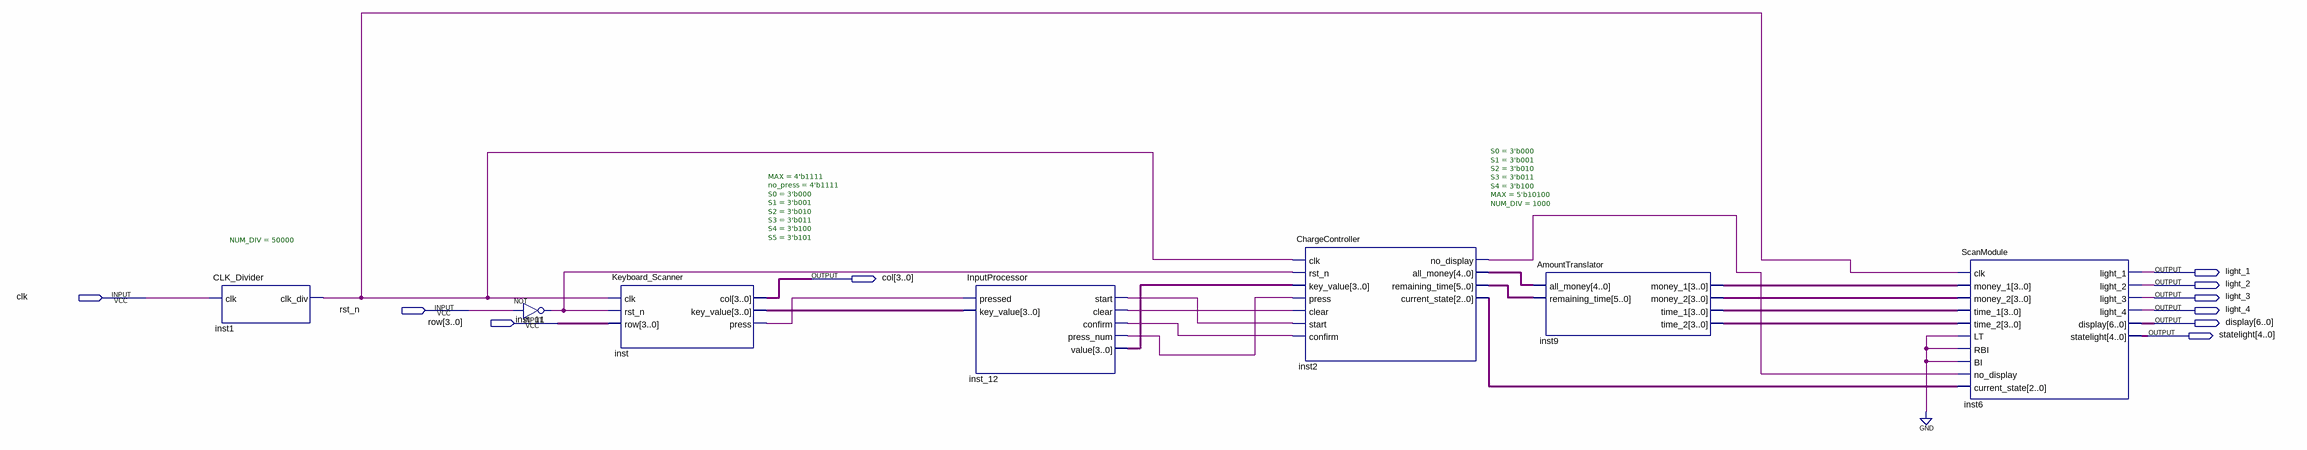
[diagram p0: schematic sheet]
// Quartus schematic main.bdf as structural Verilog: 7 symbols, 10 pins
module main (
  input  clk,
  input  rst_n,
  input  [3:0] row,
  output light_1,
  output [3:0] col,
  output light_2,
  output light_3,
  output light_4,
  output [6:0] display,
  output [4:0] statelight
);

  wire inst1_clk_div, inst2_no_display, inst_11_out, inst_12_clear, inst_12_confirm, inst_12_press_num,
       inst_12_start, inst_press;
  wire [2:0] inst2_current_state;
  wire [3:0] inst9_money_1, inst9_money_2, inst9_time_1, inst9_time_2, inst_12_value, inst_key_value;
  wire [4:0] inst2_all_money;
  wire [5:0] inst2_remaining_time;

  CLK_Divider #(.NUM_DIV(50000)) inst1 (.clk(clk), .clk_div(inst1_clk_div));
  not inst_11 (inst_11_out, rst_n);
  Keyboard_Scanner #(.MAX(4'b1111), .no_press(4'b1111), .S0(3'b000), .S1(3'b001), .S2(3'b010), .S3(3'b011), .S4(3'b100), .S5(3'b101)) inst (
    .clk(inst1_clk_div), .rst_n(inst_11_out), .row(row), .col(col), .key_value(inst_key_value),
    .press(inst_press));
  InputProcessor inst_12 (
    .pressed(inst_press), .key_value(inst_key_value), .start(inst_12_start), .clear(inst_12_clear),
    .confirm(inst_12_confirm), .press_num(inst_12_press_num), .value(inst_12_value));
  ChargeController #(.S0(3'b000), .S1(3'b001), .S2(3'b010), .S3(3'b011), .S4(3'b100), .MAX(5'b10100), .NUM_DIV(1000)) inst2 (
    .clk(inst1_clk_div), .rst_n(inst_11_out), .key_value(inst_12_value), .press(inst_12_press_num),
    .clear(inst_12_clear), .start(inst_12_start), .confirm(inst_12_confirm), .no_display(inst2_no_display),
    .all_money(inst2_all_money), .remaining_time(inst2_remaining_time), .current_state(inst2_current_state));
  AmountTranslator inst9 (
    .all_money(inst2_all_money), .remaining_time(inst2_remaining_time), .money_1(inst9_money_1),
    .money_2(inst9_money_2), .time_1(inst9_time_1), .time_2(inst9_time_2));
  ScanModule inst6 (
    .clk(inst1_clk_div), .money_1(inst9_money_1), .money_2(inst9_money_2), .time_1(inst9_time_1),
    .time_2(inst9_time_2), .LT(1'b0), .RBI(1'b0), .BI(1'b0), .no_display(inst2_no_display),
    .current_state(inst2_current_state), .light_1(light_1), .light_2(light_2), .light_3(light_3),
    .light_4(light_4), .display(display), .statelight(statelight));
endmodule
